# EAGLE design micro-regul (EAGLE 5.10)
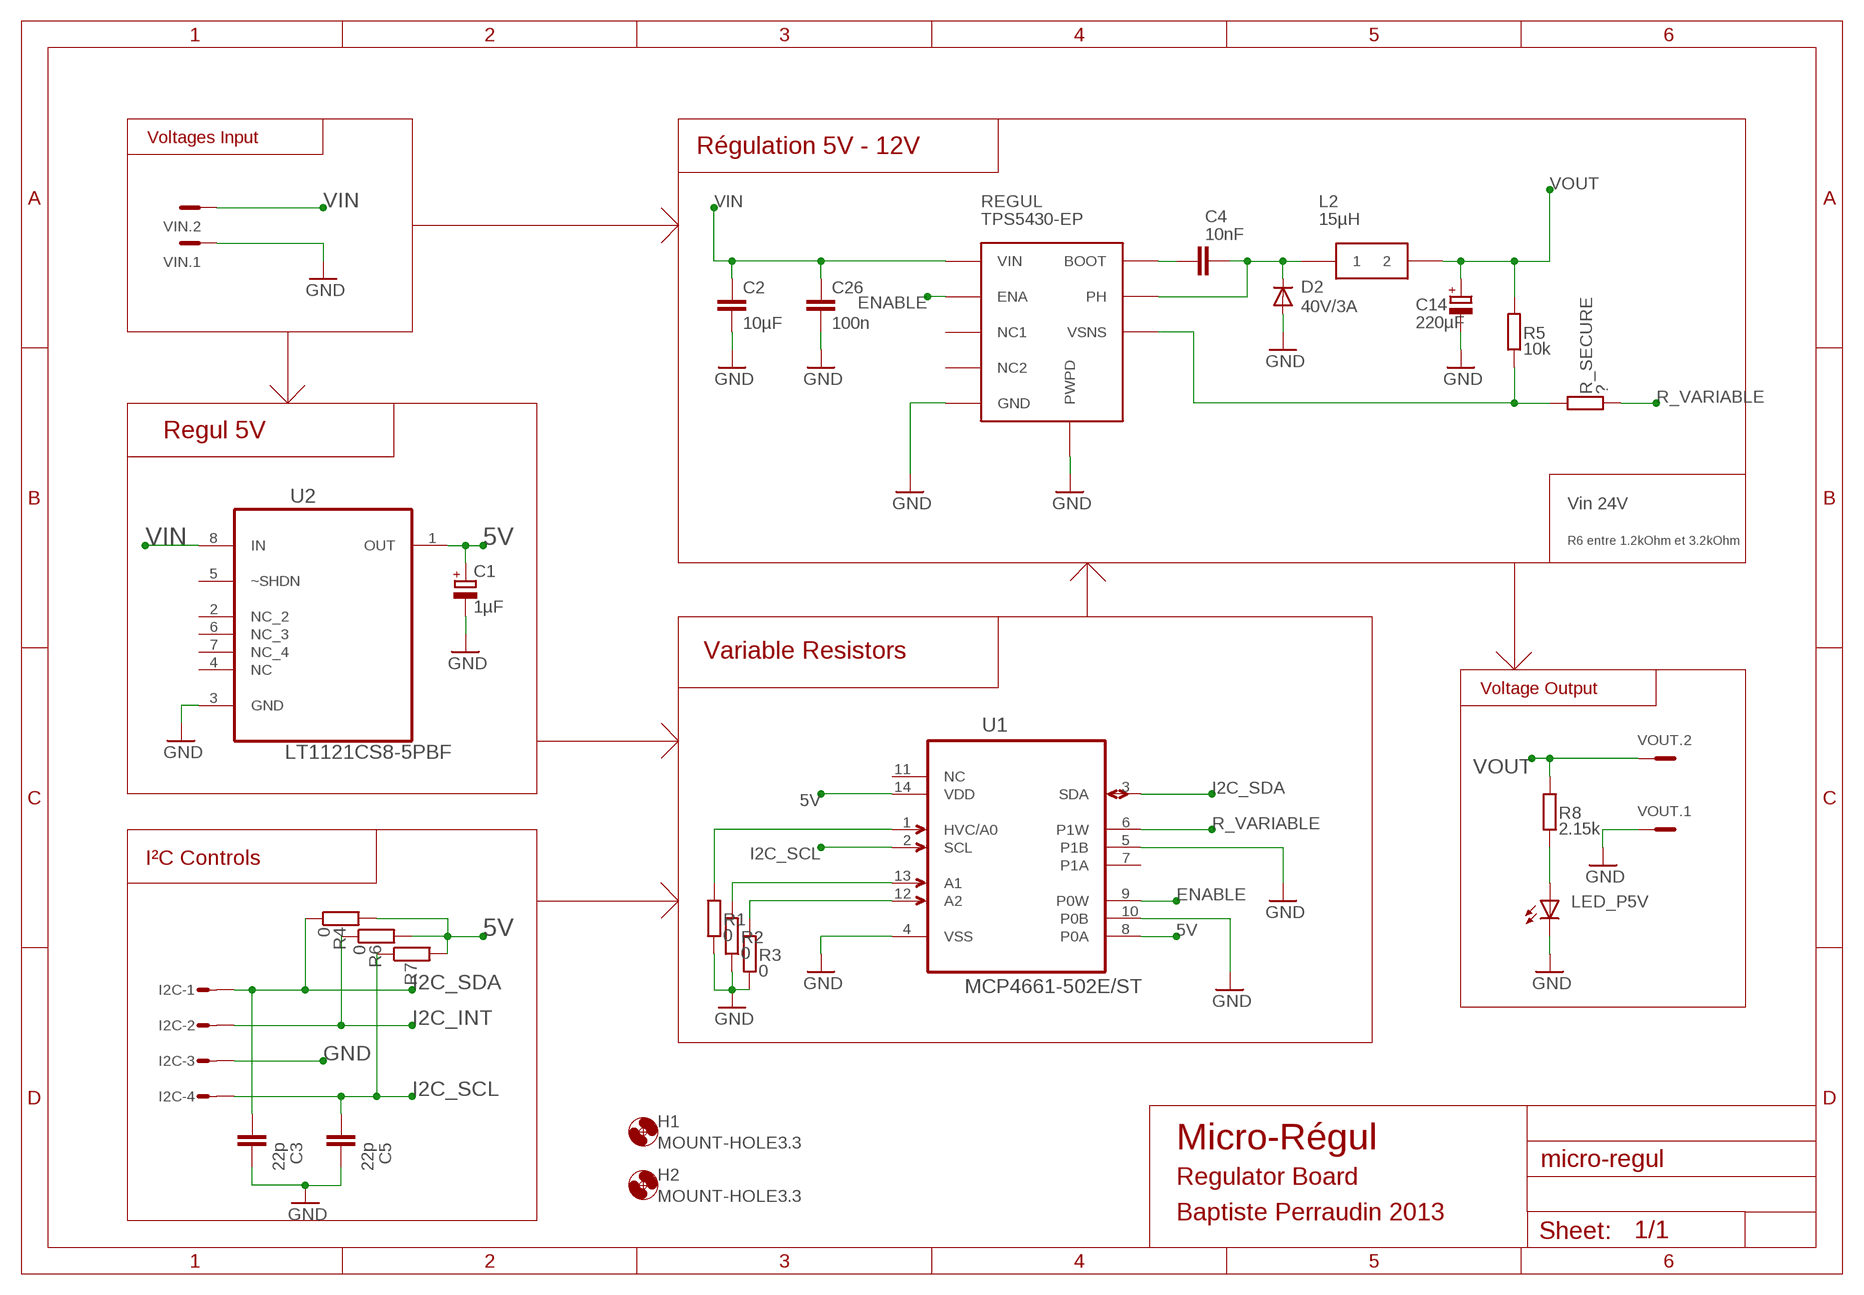
[diagram p0: schematic, sheet 1]

## Parts
C1  1µF  CPOL-EUA  [PANASONIC_A]
C2  10µF  C-EUC1210  [C1210]
C3  22p  C-EUC0603  [C0603]
C4  10nF  C-EUC0603  [C0603]
C5  22p  C-EUC0603  [C0603]
C14  220µF  CPOL-EUD/7343-31R  [D/7343-31R]
C26  100n  C-EUC0603  [C0603]
D2  40V/3A  DIODE-SMB  [SMB]
H1  MOUNT-HOLE3.3  [3,3]
H2  MOUNT-HOLE3.3  [3,3]
I2C  MICROMATCH-4-SIDE  [MICROMATCH-4-SIDE]
L2  15µH  INDUCTANCE1  [INDUCTANCE]
LED_P5V  Bling  LEDCHIPLED_1206  [CHIPLED_1206]
R1  0  R-EU_R0603  [R0603]
R2  0  R-EU_R0603  [R0603]
R3  0  R-EU_R0603  [R0603]
R4  0  R-EU_R0603  [R0603]
R5  10k  R-EU_R0603  [R0603]
R6  0  R-EU_R0603  [R0603]
R7  0  R-EU_R0603  [R0603]
R8  2.15k  R-EU_R0603  [R0603]
R_SECURE  ?  R-EU_R0603  [R0603]
REGUL  TPS5450-EP  TPS5430-EP  [TPS5430-EP]
U1  MCP4661-502E/ST  [SOP65P640X120-14N]
U2  LT1121CS8-5PBF  [SOIC127P600X175-8N]
VIN  MC2  [MC2]
VOUT  MC2  [MC2]

## Nets
5V: C1.+ R4.2 R6.2 R7.2 U1.8(P0A) U1.14(VDD) U2.1(OUT)
ENABLE: REGUL.P$5(ENA) U1.9(P0W)
GND [supply]: C1.- C2.2 C3.2 C5.2 C14.- C26.2 D2.A I2C.3 LED_P5V.C R1.1 R2.1 R3.1 REGUL.P$6(GND) REGUL.P$9(PWPD) U1.4(VSS) U1.5(P1B) U1.10(P0B) U2.3(GND) VIN.1 VOUT.1
I2C_INT: I2C.2 R6.1
I2C_SCL: C5.1 I2C.4 R7.1 U1.2(SCL)
I2C_SDA: C3.1 I2C.1 R4.1 U1.3(SDA)
N$1: R1.2 U1.1(HVC/A0)
N$2: C4.1 REGUL.P$1(BOOT)
N$3: R2.2 U1.13(A1)
N$4: R3.2 U1.12(A2)
N$6: C4.2 D2.C L2.P$1 REGUL.P$8(PH)
N$24: LED_P5V.A R8.2
R_VARIABLE: R_SECURE.1 U1.6(P1W)
RETURN_SIGNAL: R5.1 R_SECURE.2 REGUL.P$4(VSNS)
VIN [supply]: C2.1 C26.1 REGUL.P$7(VIN) U2.8(IN) VIN.2
VOUT: C14.+ L2.P$2 R5.2 R8.1 VOUT.2
Unconnected: REGUL.P$2(NC1) REGUL.P$3(NC2) U1.7(P1A) U1.11(NC) U2.2(NC_2) U2.4(NC) U2.5(~SHDN) U2.6(NC_3) U2.7(NC_4)

## Notes on the sheet
- Voltages Input
- Régulation 5V - 12V
- Regul 5V
- Vin 24V
- R6 entre 1.2kOhm et 3.2kOhm
- Variable Resistors
- Voltage Output
- I²C Controls
- Micro-Régul
- Regulator Board
- Baptiste Perraudin 2013

## Library data of the parts
C1 C14 = rcl:CPOL-EU: POLARIZED CAPACITOR, European symbol
C2-C5 C26 = rcl:C-EU: CAPACITOR, European symbol
D2 = diode:DIODE-: DIODE
H1 H2 = holes:MOUNT-HOLE: MOUNTING HOLE with drill center marker
I2C = apbteam_con-amp-micromatch:MICROMATCH-4: MicroMaTch 4
L2 = apbTeam:INDUCTANCE1: 12x12 mm
LED_P5V = led:LED: LED OSRAM: - CHIPLED LG R971, LG N971, LY N971, LG Q971, LY Q971, LO R971, LY R971 LH N974, LH R974 LS Q976, LO Q976, LY Q976 LO Q996 - Hyper CHIPLED LW Q18S LB Q993, LB Q99A, LB R99A - SideLED LS A670, LO A670, LY A670, LG A670, LP A670 LB A673, LV A673, LT A673, LW A673 LH A674 LY A675 LS A676, LA A676, LO A676, LY A676, LW A676 LS A679, LY A679, LG A679 - Hyper Micro SIDELED® LS Y876, LA Y876, LO Y876, LY Y876 LT Y87S - SmartLED LW L88C, LW L88S LB L89C, LB L89S, LG L890 LS L89K, LO L89K, LY L89K LS L896, LA L896, LO L896, LY L896 - TOPLED LS T670, LO T670, LY T670, LG T670, LP T670 LSG T670, LSP T670, LSY T670, LOP T670, LYG T670 LG T671, LOG T671, LSG T671 LB T673, LV T673, LT T673, LW T673 LH T674 LS T676, LA T676, LO T676, LY T676, LB T676, LH T676, LSB T676, LW T676 LB T67C, LV T67C, LT T67C, LS T67K, LO T67K, LY T67K, LW E67C LS E67B, LA E67B, LO E67B, LY E67B, LB E67C, LV E67C, LT E67C LW T67C LS T679, LY T679, LG T679 LS T770, LO T770, LY T770, LG T770, LP T770 LB T773, LV T773, LT T773, LW T773 LH T774 LS E675, LA E675, LY E675, LS T675 LS T776, LA T776, LO T776, LY T776, LB T776 LHGB T686 LT T68C, LB T68C - Hyper Mini TOPLED® LB M676 - Mini TOPLED Santana® LG M470 LS M47K, LO M47K, LY M47K Source: http://www.osram.convergy.de/
R1-R8 R_SECURE = rcl:R-EU_: RESISTOR, European symbol
REGUL = apbTeam:TPS5430-EP
U1 = MCP4661:MCP4661-502E/ST: Digital POT; MPN: MCP4661-502E/ST; OC_FARNELL: 1840750; OC_NEWARK: 77M3010; PACKAGE: SOP-14; SUPPLIER: Microchip
U2 = LT1121CS8-5:LT1121CS8-5PBF: Micropower Low Dropout Regulators with Shutdown; MPN: LT1121CS8-5#PBF; OC_FARNELL: 9560076; OC_NEWARK: 57M1925; PACKAGE: SOIC-8; SUPPLIER: Linear Technology
VIN VOUT = con-phoenix-381_l:MC2: Mini-Combicon 3.81mm horizontal 2-polig MC 1,5/2-G-3,81 Artikel-Nr. 1803277

## Net classes
1 supply: width 0.254 mm

## Board
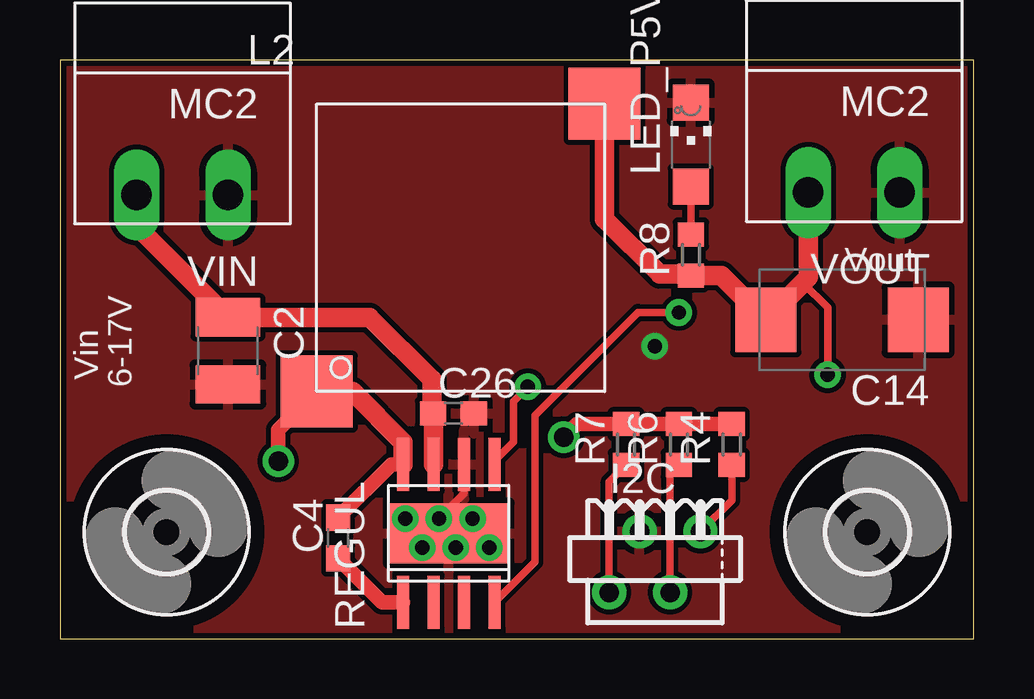
[diagram p1: board, top side]
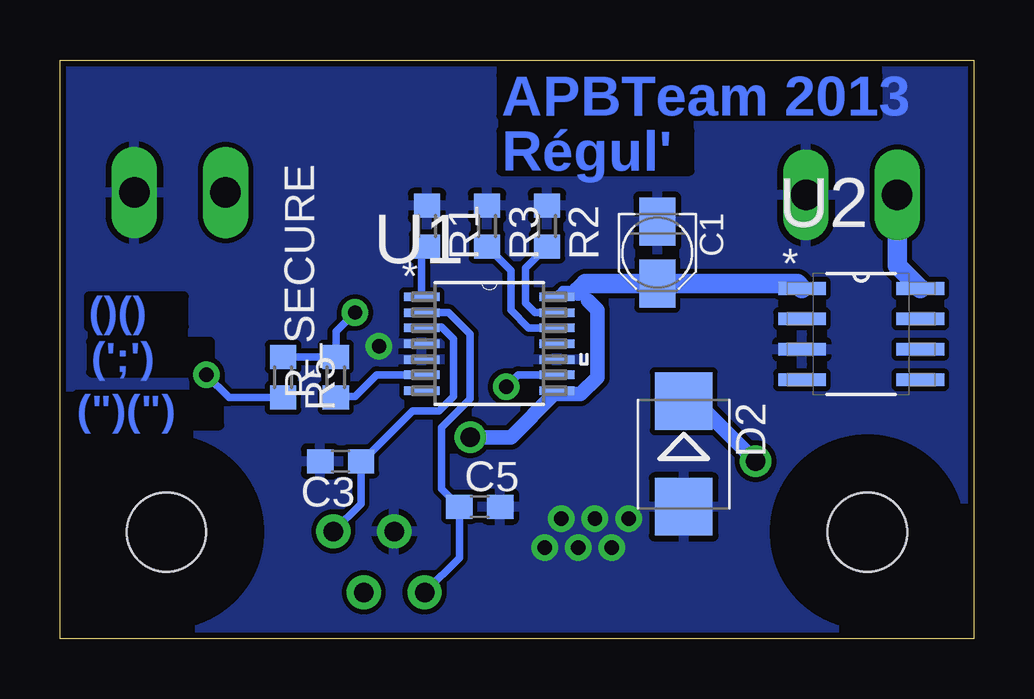
[diagram p2: board, bottom side, seen from below]

Size 38.1 x 24.13 mm. Coordinates in mm from the lower left corner, seen from the top.
Outline: 0,0 38.1,0 38.1,24.13 0,24.13 0,0
Copper layers (1*16): Top 0.035mm / dielectric 1.5mm / Bottom 0.035mm
Design rules "SparkFun": minimum track width 8mil, minimum drill 20mil, track to track 8mil, track to pad 8mil, pad to pad 8mil, via to via 8mil, smd to smd 8mil, copper to edge 10mil, drill to drill 8mil, minimum pad ring 12mil, minimum via ring 10mil, stop-mask expansion 4mil, vias tented up to drill 25mil, thermal gap 10mil

### Footprints (pad centres in the part's own frame; a part is rotated, then mirrored left to right if it is on the bottom)
PANASONIC_A = smd 2 x 1.5: + 1.3,0; - -1.3,0
C1210 = smd 1.6 x 2.7: 1 -1.4,0; 2 1.4,0
C0603 = smd 1.1 x 1: 1 -0.85,0; 2 0.85,0
D/7343-31R = smd 2.55 x 2.7: + 3.175,0; - -3.175,0
SMB = smd 2.4 x 2.4: A 2.2,0; C -2.2,0
3,3 = hole 3.3: 0,0
MICROMATCH-4-SIDE = drill 0.813 round: 1 1.905,1.27; 2 0.635,-1.27; 3 -0.635,1.27; 4 -1.905,-1.27
INDUCTANCE = smd 3 x 3: P$1 -6,-6; P$2 6,6
CHIPLED_1206 = smd 1.5 x 1.5: A 0,-1.75; C 0,1.75
R0603 = smd 1 x 1.1: 1 -0.85,0; 2 0.85,0
TPS5430-EP = smd 2.2 x 0.5: P$1 -0.88,4.39; P$2 -0.88,3.12; P$3 -0.88,1.85; P$4 -0.88,0.58; P$5 4.87,0.58; P$6 4.87,1.85; P$7 4.87,3.12; P$8 4.87,4.39 | smd 2.5 x 5: P$9 2,2.5
SOP65P640X120-14N = smd 1.473 x 0.356: 1 -2.819,1.956; 2 -2.819,1.295; 3 -2.819,0.66; 4 -2.819,0; 5 -2.819,-0.66; 6 -2.819,-1.295; 7 -2.819,-1.956; 8 2.819,-1.956; 9 2.819,-1.295; 10 2.819,-0.66; 11 2.819,0; 12 2.819,0.66; 13 2.819,1.295; 14 2.819,1.956
SOIC127P600X175-8N = smd 1.981 x 0.533: 1 -2.464,1.905; 2 -2.464,0.635; 3 -2.464,-0.635; 4 -2.464,-1.905; 5 2.464,-1.905; 6 2.464,-0.635; 7 2.464,0.635; 8 2.464,1.905
MC2 = drill 1.27 long: 1 -1.905,0; 2 1.905,0

### Placement (x,y rotation side)
C1  13.2,16.1 270 bottom
C2  7,12 270 top
C3  26.4,7.4 180 bottom
C4  11.6,4.2 90 top
C5  20.6,5.5 0 bottom
C14  32.6,13.3 180 top
C26  16.4,9.4 0 top
D2  12.1,7.7 270 bottom
H1  4.45,4.45 0 top
H2  33.66,4.45 0 top
I2C  24.8,3.2 0 top
L2  16.7,16.3 0 top
LED_P5V  26.3,20.6 0 top
R1  22.8,17.2 270 bottom
R2  17.8,17.2 270 bottom
R3  20.3,17.2 270 bottom
R4  28,8.1 90 top
R5  28.8,10.9 270 bottom
R6  25.8,8.1 90 top
R7  23.6,8.1 90 top
R8  26.3,16 90 top
R_SECURE  26.6,10.9 90 bottom
REGUL  18.7,2.4 90 top
U1  20.2,12.3 0 bottom
U2  4.7,12.7 0 bottom
VIN  5.1,18.5 180 top
VOUT  33.1,18.6 180 top

### Tracks (layer width: path | path; a pad name or v marks a point on that pad's centre or on a via)
5V  (via drill 0.8)
  Top 0.61: R4.2 R6.2 R7.2 21.55,8.95 v21,8.4
  Bottom 0.305: U1.14 16.26,14.26 16.1,14.1 | 17.5,10.2 17.5,10.22 U1.8
  Bottom 0.406: 16.5,14.5 17.14,14.5 U1.14
  Bottom 0.61: 16.1,14.1 15.7,13.7 15.7,10.9 16.4,10.2 17.5,10.2 19.3,8.4 v21,8.4
  Bottom 0.813: U2.1 7.36,14.8 C1.+ 16.2,14.8 16.5,14.5
ENABLE  (via drill 0.6)
  Top 0.305: REGUL.P$5 18.12,7.42 18.9,8.2 18.9,9.9 v19.5,10.5
  Bottom 0.305: U1.9 19,11 v19.5,10.5
GND  (via drill 0.6)
  Top 0.305: REGUL.P$6 16.85,6.05 v15.8,5
  other vias: 14.4,5 17.2,5 17.9,3.8 16.5,3.8 15.1,3.8 24.8,12.2
  pour Top: 0.1,24 38,24 38,-0.1 0,-0.1 0,24.1
  pour Bottom: 0,24.1 38.1,24.1 38.1,-0.1 0,-0.1
I2C_INT
  Top 0.305: 25.8,7.1 R6.1 25.43,6.88 I2C.2
I2C_SCL
  Top 0.305: I2C.4 22.89,6.54 R7.1
  Bottom 0.305: U1.2 21.89,13.6 21,12.7 21,10 22.2,8.8 22.2,6.25 C5.1 21.45,3.38 I2C.4
I2C_SDA
  Top 0.305: I2C.1 28,5.76 R4.1
  Bottom 0.305: I2C.1 25.55,5.62 C3.1 25.5,7.4 23.4,9.5 22.3,9.5 21.7,10.1 21.7,12.5 22.2,13 22.98,13 U1.3
N$1
  Bottom 0.305: U1.1 23.02,16.13 R1.2
N$2
  Top 0.61: C4.1 13.43,1.52 REGUL.P$1
N$3
  Bottom 0.305: U1.13 18.3,13.6 18.7,14 18.7,15.45 R2.2
N$4
  Bottom 0.305: U1.12 18.56,12.96 19.3,13.7 19.3,15.35 R3.2
N$6  (via drill 0.8)
  Top 0.61: REGUL.P$8 13.82,7.27 C4.2 | v9.1,7.4 9.1,8.7 L2.P$1
  Top 0.813: REGUL.P$8 14.31,8.19 12.2,10.3 L2.P$1
  Bottom 0.61: D2.C 11.6,9.9 v9.1,7.4
N$24
  Top 0.305: R8.2 LED_P5V.A
R_VARIABLE
  Bottom 0.305: U1.6 24.89,11.01 25.8,10.1 26.55,10.1 R_SECURE.1
RETURN_SIGNAL  (via drill 0.6)
  Top 0.305: v25.8,13.6 24.1,13.6 19.8,9.3 19.8,3.2 REGUL.P$4
  Bottom 0.305: R5.1 R_SECURE.2 26.6,12.8 v25.8,13.6
VIN
  Top 0.813: VIN.2 3.19,17.2 C2.1 12.9,13.4 15.5,10.8 15.5,9.45 C26.1 15.58,9.37 REGUL.P$7
  Bottom 0.813: U2.8 3.19,15.56 VIN.2
VOUT  (via drill 0.6)
  Top 0.305: v32,11 32,13.8 30.96,14.84
  Top 0.813: L2.P$2 22.7,17.5 25,15.2 26.25,15.2 R8.1 | R8.1 26.3,15.12 | R8.1 27.57,15.15 C14.+ 30.96,14.84 31.2,15.07 VOUT.2
  Bottom 0.305: R5.2 31.05,10.05 v32,11

### Text on the board
Bottom: APBTeam 2013 | Régul' | ()() | (';') | (")(")
tSilk: Vout | Vin | 6-17V